# EAGLE design led2001-buck-flashlight-driver-17mm-mk-1.0 (EAGLE 6.6.0)
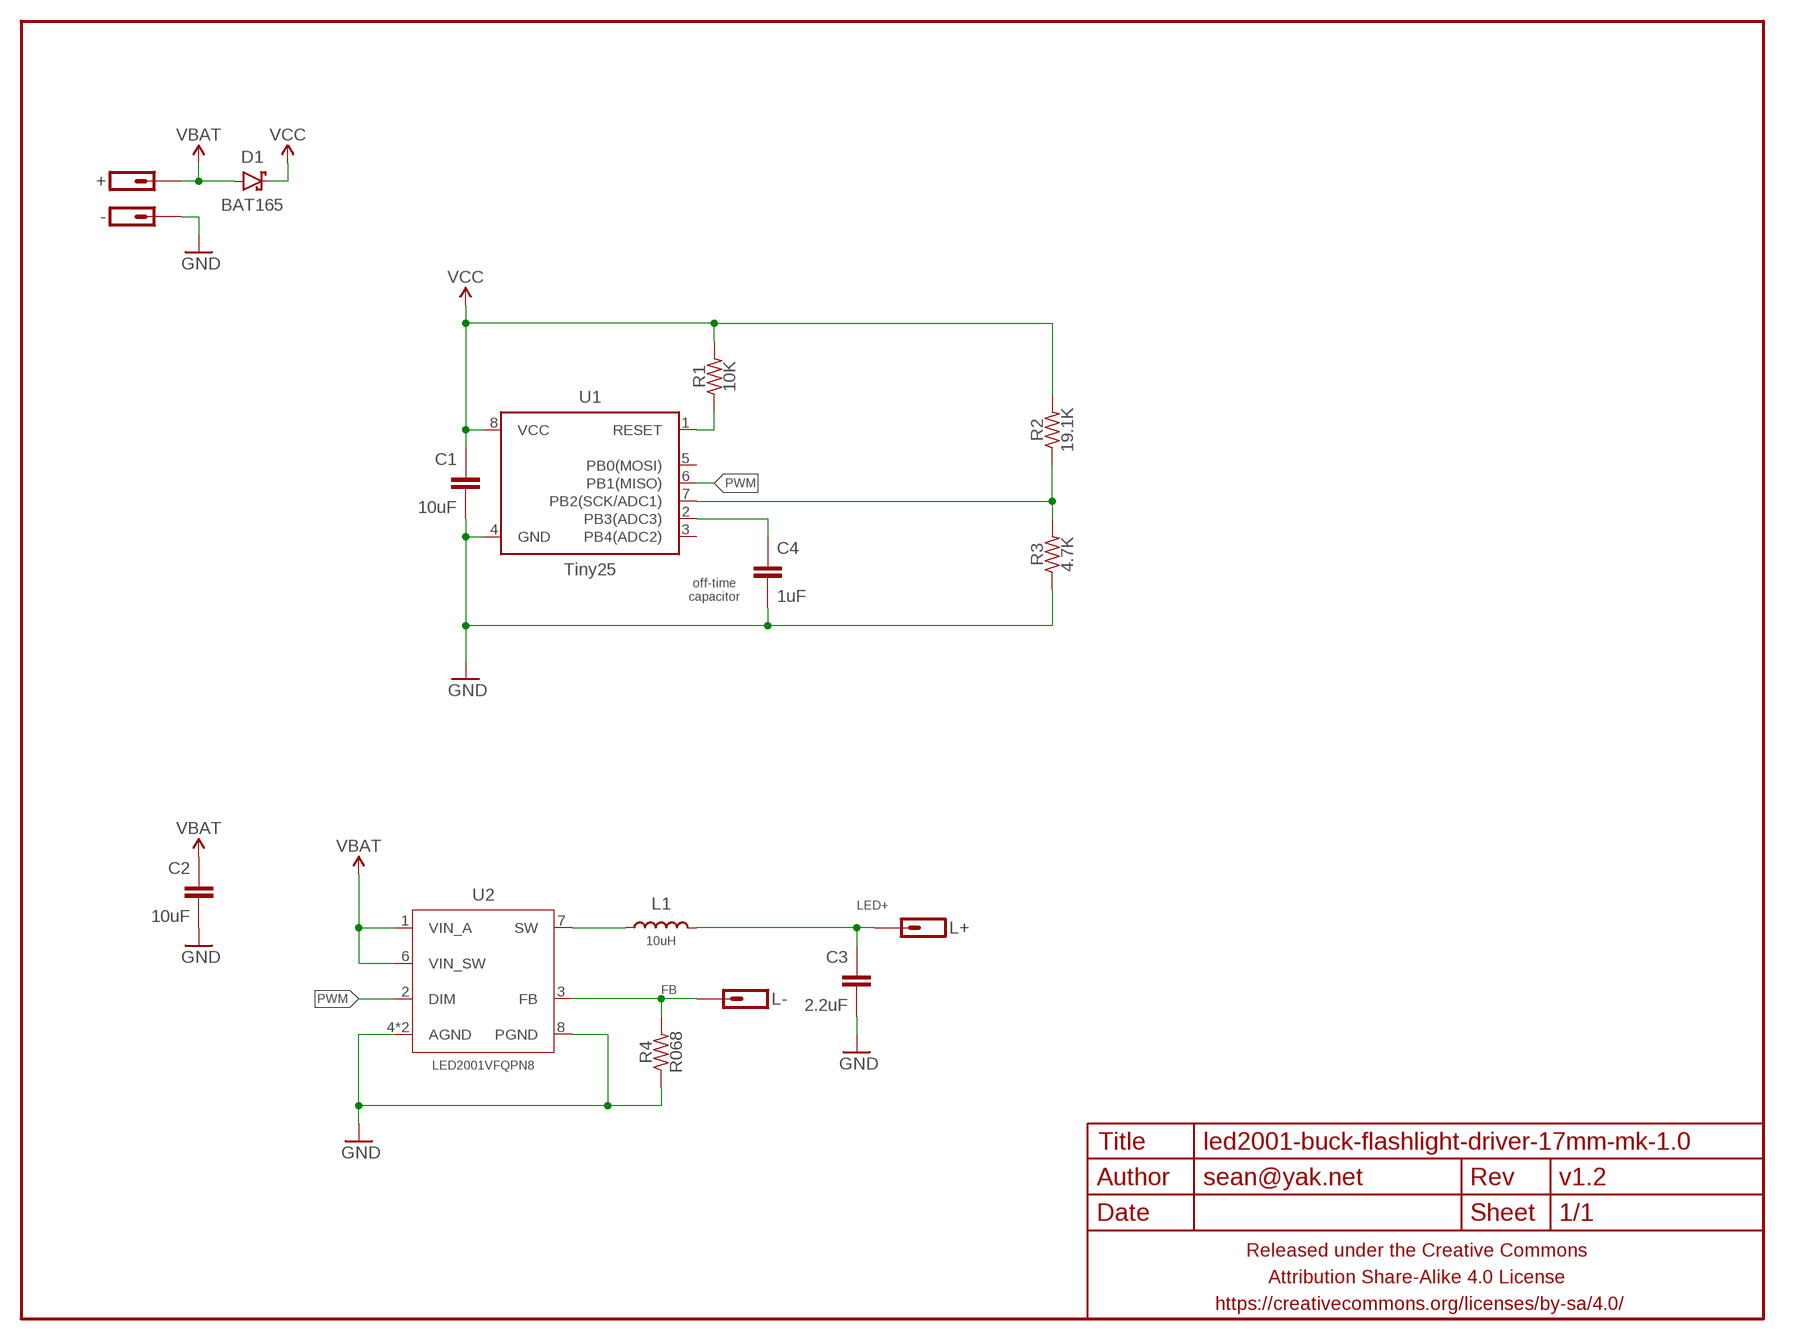
[diagram p0: schematic, sheet 1]

## Parts
+  M01PTH-1MM-CIR-NS  [1X01-1MM-CIR-NS]
-  M01NOT-A-VIA-NOPE  [1X01_NOSILK_NOSTOP]
C1  10uF  CAPACITOR-CERAMICC0603-TIGHTER  [C0603-TIGHTER]
C2  10uF  CAPACITOR-CERAMICC0603-TIGHTER  [C0603-TIGHTER]
C3  2.2uF  CAPACITOR-CERAMICC0603-TIGHTER  [C0603-TIGHTER]
C4  1uF  CAPACITOR-CERAMICC0402  [C0402]
D1  BAT165  DIODE-SCHOTTKYSOD323  [SOD323-SCHOTTKY]
FRAME1  FRAME-LETTERNO_PACKAGE  [DUMMY]
L1  10uH  INDUCTORXAL40X0  [XAL40X0]
L+  M01PTH-1MM-CIR-NS  [1X01-1MM-CIR-NS]
L-  M01PTH-1MM-CIR-NS  [1X01-1MM-CIR-NS]
R1  10K  RESISTORR0402  [R0402]
R2  19.1K  RESISTORR0603-TIGHTER  [R0603-TIGHTER]
R3  4.7K  RESISTORR0603-TIGHTER  [R0603-TIGHTER]
R4  R068  RESISTORR0805-TIGHTER  [R0805-TIGHTER]
U1  Tiny25  ATTINY45TINY25-SOICN-NARROWER  [SO08-SKINNYPADS]
U2  LED2001VFQPN8  [VFQFPN8-4X4]

## Nets
FB: L-.1 R4.2 U2.3(FB)
GND: -.P$1 C1.2 C2.2 C3.2 C4.2 R3.1 R4.1 U1.4(GND) U2.4(AGND) U2.8(PGND) U2.9(AGND)
LED+: C3.1 L1.P$2 L+.1
N$1: L1.P$1 U2.7(SW)
N$2: R1.1 U1.1(RESET)
N$3: R2.1 R3.2 U1.7(PB2(SCK/ADC1))
N$5: C4.1 U1.2(PB3(ADC3))
PWM: U1.6(PB1(MISO)) U2.2(DIM)
VBAT: +.1 C2.1 D1.A U2.1(VIN_A) U2.6(VIN_SW)
VCC: C1.1 D1.C R1.2 R2.2 U1.8(VCC)
Unconnected: U1.3(PB4(ADC2)) U1.5(PB0(MOSI))

## Notes on the sheet
- off-time
  capacitor

## Library data of the parts
+ - L+ L- = a_parts:M01: Header 1 Standard 1-pin 0.1" header. Use with straight break away headers (SKU : PRT-00116), right angle break away headers (PRT-00553), swiss pins (PRT-00743), machine pins (PRT-00117), and female headers (PRT-00115).
C1-C4 = a_parts:CAPACITOR-CERAMIC: CAPACITOR, European symbol
D1 = a_parts:DIODE-SCHOTTKY: Schottky diodes in SFE's production catalog BAT20J 1A 23V 0.62Vf RB751 120mA 40V 0.37Vf PMEG4005EJ 0.5A 40V 0.42Vf MBRA140 1A 40V 0.5Vf B340A 3A 40V SMA
FRAME1 = a_parts:FRAME-LETTER: Schematic Frame Standard 8.5x11 US Letter frame; DESIGNER: sean@yak.net; VERSION: v1.2
L1 = a_parts:INDUCTOR: Inductors Basic Inductor/Choke - 0603 and 1206. Footprints are not proven and vary greatly between part numbers. SRN6045- 33uH, 20% 1.4A SDR0403-560KL - 56uH, 10%, 500mA RMS/740mA peak
R1-R4 = a_parts:RESISTOR: RESISTOR, American symbol
U1 = a_parts:ATTINY45: Atmel 8-pin 2/4/8kB flash uC
U2 = a_parts:LED2001

## Board
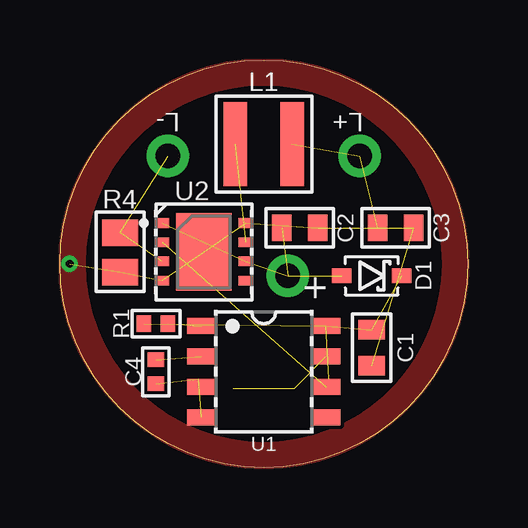
[diagram p1: board, top side]
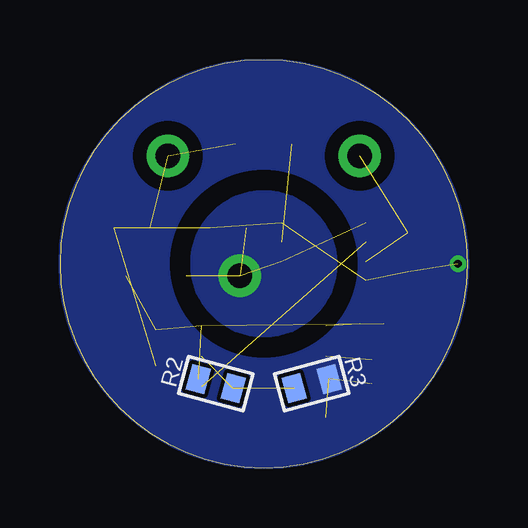
[diagram p2: board, bottom side, seen from below]

Size 17 x 17 mm. Coordinates in mm from the lower left corner, seen from the top.
Outline: 0,8.5 arc-180 17,8.5 arc-180 0,8.5
Copper layers (1*16): Top 0.0356mm / dielectric 1.5011mm / Bottom 0.0356mm
Design rules "LaenPCBOrder2 *": minimum track width 6mil, minimum drill 13mil, track to track 6mil, track to pad 6mil, pad to pad 6mil, via to via 6mil, smd to smd 6mil, copper to edge 0mil, drill to drill 6mil, minimum pad ring 7mil, minimum via ring 7mil, stop-mask expansion 3mil, vias tented up to drill 20mil, thermal gap 10mil
bRestrict: area 11.3,11.8 to 13.7,14.2; area 3.3,11.8 to 5.7,14.2; area 5,5 to 12,12

### Footprints (pad centres in the part's own frame; a part is rotated, then mirrored left to right if it is on the bottom)
1X01-1MM-CIR-NS = drill 1.016 pad 1.778: 1 0,0
1X01_NOSILK_NOSTOP = drill 0.33: P$1 0,0
C0603-TIGHTER = smd 0.8 x 1.1: 1 -0.75,0; 2 0.75,0
C0402 = smd 0.6 x 0.7: 1 -0.5,0; 2 0.5,0
SOD323-SCHOTTKY = smd 0.8 x 0.6: A -1.25,0; C 1.25,0
XAL40X0 = smd 0.98 x 3.5: P$1 -1.185,0; P$2 1.185,0
R0402 = smd 0.6 x 0.7: 1 -0.5,0; 2 0.5,0
R0603-TIGHTER = smd 0.8 x 1.1: 1 -0.75,0; 2 0.75,0
R0805-TIGHTER = smd 1.1 x 1.5: 1 -0.85,0; 2 0.8,0
SO08-SKINNYPADS = smd 0.65 x 1.2: 1 -1.905,-2.6; 2 -0.635,-2.6; 3 0.635,-2.6; 4 1.905,-2.6; 5 1.905,2.6; 6 0.635,2.6; 7 -0.635,2.6; 8 -1.905,2.6
VFQFPN8-4X4 = smd 0.6 x 0.4: 1 -1.75,1.2; 2 -1.75,0.4; 3 -1.75,-0.4; 4 -1.75,-1.2; 5 1.75,-1.2; 6 1.75,-0.4; 7 1.75,0.4; 8 1.75,1.2 | smd 2.3 x 3.24: 9 0,0

### Placement (x,y rotation side)
+  9.5,8 180 top
-  0.4,8.5 90 bottom
C1  13,5 270 top
C2  10,10 0 top
C3  14,10 0 top
C4  4,4 270 top
D1  13,8 0 top
FRAME1  0,0 0 top
L1  8.5,13.5 0 top
L+  12.5,13 270 top
L-  4.5,13 0 top
R1  4,6 180 top
R2  10.5,3.5 165 bottom
R3  6.5,3.5 195 bottom
R4  2.5,9 90 top
U1  8.5,4 270 top
U2  6,9 0 top

### Tracks (layer width: path | path; a pad name or v marks a point on that pad's centre or on a via)
FB  (2 unrouted)
GND  (9 unrouted)
  pour Top (isolate 0.152, rank 6, no thermals): 0,8.5 arc90 8.5,0 arc90 17,8.5 16,8.5 arc-90 8.5,1 arc-90 1,8.5
  pour Bottom (isolate 0.152, rank 6, no thermals): 8.5,0 arc-90 0,8.5 arc-90 8.5,17 arc-90 17,8.5 arc-90
  pour Top (isolate 0.152, rank 6, no thermals): 17,8.5 arc90 8.5,17 arc90 0,8.5 1,8.5 arc-90 8.5,16 arc-90 16,8.5
LED+  (2 unrouted)
N$1  (1 unrouted)
N$2  (1 unrouted)
N$3  (2 unrouted)
N$5  (1 unrouted)
PWM  (1 unrouted)
VBAT  (4 unrouted)
  pour Bottom (isolate 0.152, no thermals): 5.5,8.5 arc-180 11.5,8.5 arc-180
VCC  (4 unrouted)

### Text on the board
bPlace: LM3410 Boost / Flashlight Driver